# EAGLE design AS3364_quad_mixer_0402_DIL-inv_v1.0 (EAGLE 7.7.0)
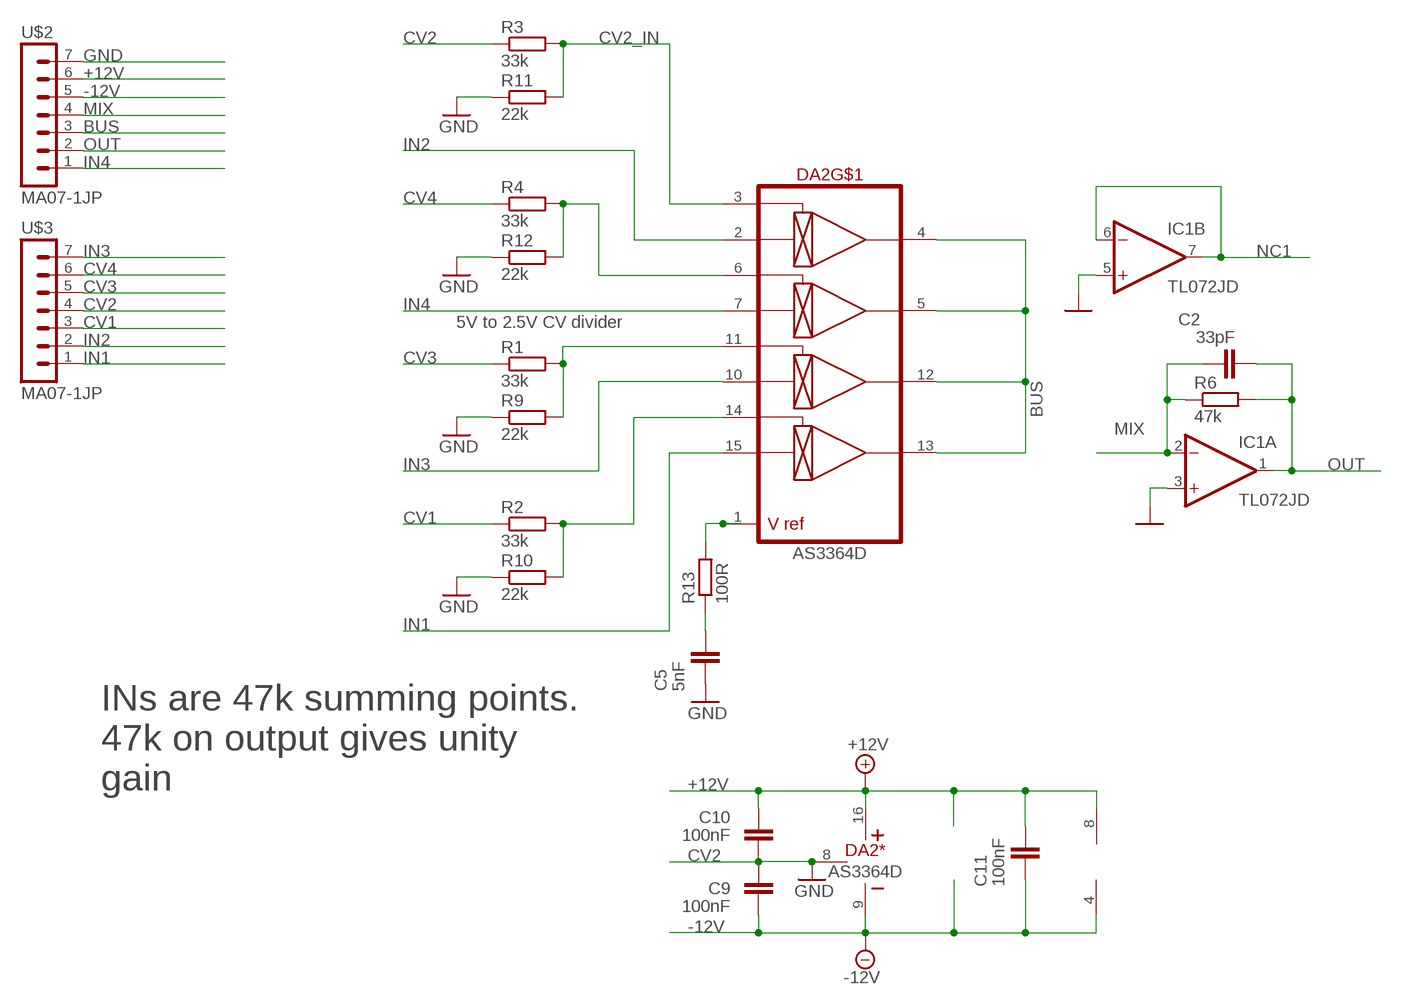
[diagram p0: schematic, sheet 1]

## Parts
C2  33pF  C-EUC0402  [C0402]
C5  5nF  C-EUC0402  [C0402]
C9  100nF  C-EUC0402  [C0402]
C10  100nF  C-EUC0402  [C0402]
C11  100nF  C-EUC0402  [C0402]
DA2  AS3364D  [DIL16J]
IC1  TL072JD  [SO08J]
R1  33k  R-EU_R0402  [R0402]
R2  33k  R-EU_R0402  [R0402]
R3  33k  R-EU_R0402  [R0402]
R4  33k  R-EU_R0402  [R0402]
R6  47k  R-EU_R0402  [R0402]
R9  22k  R-EU_R0402  [R0402]
R10  22k  R-EU_R0402  [R0402]
R11  22k  R-EU_R0402  [R0402]
R12  22k  R-EU_R0402  [R0402]
R13  100R  R-EU_R0402  [R0402]
U$2  MA07-1JP  [SIP-PIN07-1J]
U$3  MA07-1JP  [SIP-PIN07-1J]

## Nets
+12V: C10.2 C11.2 DA2.16(*:V+) IC1.8(P:V+) U$2.6
-12V: C9.1 C11.1 DA2.9(*:V-) IC1.4(P:V-) U$2.5
BUS: DA2.4(OUT1) DA2.5(OUT2) DA2.12(OUT3) DA2.13(OUT4) U$2.3
CV1: R2.1 U$3.3
CV2: R3.1 U$3.4
CV2_IN: DA2.3(CV1) R3.2 R11.2
CV3: R1.1 U$3.5
CV4: R4.1 U$3.6
GND: C5.1 C9.2 C10.1 DA2.8(*:GND) IC1.3(A:+IN) IC1.5(B:+IN) R9.1 R10.1 R11.1 R12.1 U$2.7
IN1: DA2.15(IN4) U$3.1
IN2: DA2.2(IN1) U$3.2
IN3: DA2.10(IN3) U$3.7
IN4: DA2.7(IN2) U$2.1
MIX: C2.1 IC1.2(A:-IN) R6.1 U$2.4
N$2: DA2.1(VREF) R13.2
N$10: DA2.6(CV2) R4.2 R12.2
N$12: DA2.11(CV3) R1.2 R9.2
N$14: C5.2 R13.1
N$21: DA2.14(CV4) R2.2 R10.2
NC1: IC1.6(B:-IN) IC1.7(B:OUT)
OUT: C2.2 IC1.1(A:OUT) R6.2 U$2.2

## Notes on the sheet
- 5V to 2.5V CV divider
- INs are 47k summing points.
  47k on output gives unity
  gain

## Library data of the parts
C2 C5 C9-C11 = rcl:C-EU: CAPACITOR, European symbol; SPICEPREFIX: C
DA2 = joakim:AS3364: AS3364 quad linear VCA, CEM3360 style. CV is 0 to 2V Vcc-Vee = 26V max, so +/-12V or +15V/-9V
IC1 = joakim:TL072J: OP AMP
R1-R4 R6 R9-R13 = rcl:R-EU_: RESISTOR, European symbol; SPICEPREFIX: R
U$2 U$3 = joakim:MA07-1J

## Board
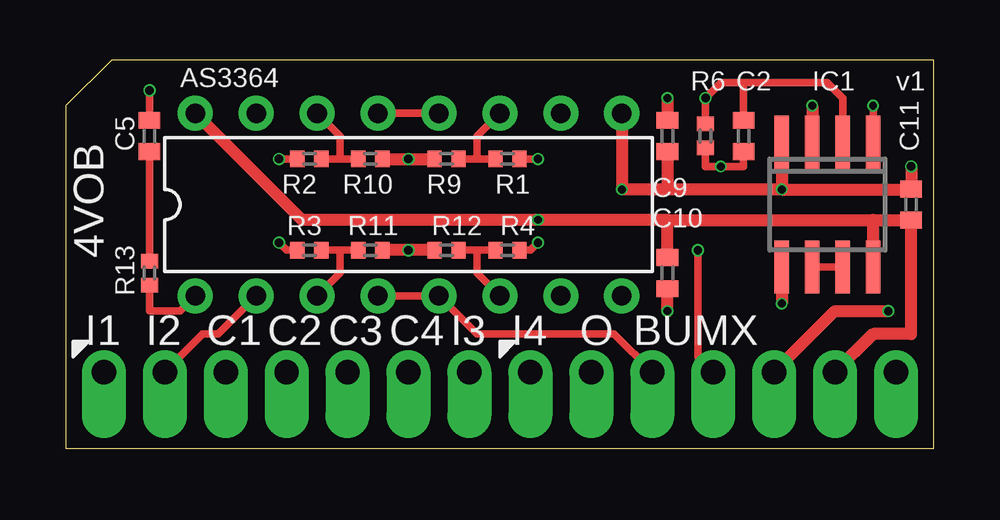
[diagram p1: board, top side]
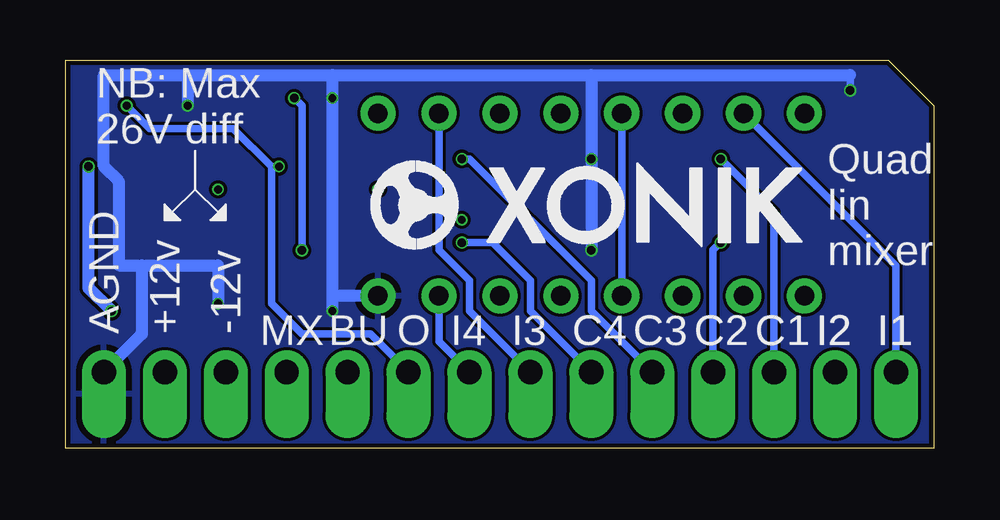
[diagram p2: board, bottom side, seen from below]

Size 36.2 x 16.19 mm. Coordinates in mm from the lower left corner, seen from the top.
Outline: 0,0 36.2,0 36.2,16.19 1.91,16.19 0,14.29 0,0
Copper layers (1*16): Top 0.035mm / dielectric 1.6mm / Bottom 0.035mm
Design rules "jlcpcb-2layers": minimum track width 5mil, minimum drill 0.3mm, track to track 5mil, track to pad 5mil, pad to pad 5mil, via to via 5mil, smd to smd 5mil, copper to edge 0.2mm, drill to drill 6mil, minimum pad ring 10mil, minimum via ring 3mil, stop-mask expansion 4mil, vias tented up to drill 0mil, thermal gap 10mil

### Footprints (pad centres in the part's own frame; a part is rotated, then mirrored left to right if it is on the bottom)
C0402 = smd 0.7 x 0.9: 1 -0.65,0; 2 0.65,0
DIL16J = drill 0.813: 1 -8.89,-3.81; 2 -6.35,-3.81; 3 -3.81,-3.81; 4 -1.27,-3.81; 5 1.27,-3.81; 6 3.81,-3.81; 7 6.35,-3.81; 8 8.89,-3.81; 9 8.89,3.81; 10 6.35,3.81; 11 3.81,3.81; 12 1.27,3.81; 13 -1.27,3.81; 14 -3.81,3.81; 15 -6.35,3.81; 16 -8.89,3.81
SO08J = smd 0.6 x 2.2: 1 -1.905,-2.6; 2 -0.635,-2.6; 3 0.635,-2.6; 4 1.905,-2.6; 5 1.905,2.6; 6 0.635,2.6; 7 -0.635,2.6; 8 -1.905,2.6
R0402 = smd 0.6 x 0.7: 1 -0.5,0; 2 0.5,0
SIP-PIN07-1J = drill 1.016 offset: 1 -7.62,0; 2 -5.08,0; 3 -2.54,0; 4 0,0; 5 2.54,0; 6 5.08,0; 7 7.62,0

### Placement (x,y rotation side)
C2  28.26,13.02 270 top
C5  3.49,13.02 270 top
C9  25.08,13.02 90 top
C10  25.08,7.3 90 top
C11  35.24,10.16 270 top
DA2  14.29,10.16 0 top
IC1  31.75,10.16 180 top
R1  18.41,12.06 180 top
R2  10.16,12.06 0 top
R3  10.16,8.26 0 top
R4  18.41,8.26 180 top
R6  26.67,13.02 270 top
R9  15.88,12.06 0 top
R10  12.7,12.06 180 top
R11  12.7,8.26 180 top
R12  15.88,8.26 0 top
R13  3.49,7.3 270 top
U$1  [XONIK_LOGO_18]  23.5,8.31 0 bottom
U$2  26.99,3.17 0 top
U$3  9.21,3.17 0 top

### Tracks (layer width: path | path; a pad name or v marks a point on that pad's centre or on a via)
+12V  (via drill 0.33)
  Top 0.508: 25.08,9.53 33.66,9.53 | 25.08,9.53 v19.68,9.53 9.84,9.53 DA2.16 | C10.2 25.08,9.53 | IC1.8 33.66,9.53 | 33.66,9.53 35.23,9.53 C11.2 35.24,4.76 33.66,4.76 U$2.6
-12V  (via drill 0.33, 0.35)
  Top 0.508: IC1.4 v29.84,10.79 | v29.84,10.79 25.08,10.79 | 25.08,10.79 v23.18,10.79 DA2.9 | C9.1 25.08,10.79 | U$2.5 32.07,5.71 v34.29,5.71 | v35.24,11.75 C11.1 35.23,10.79 v29.84,10.79
  Bottom 0.508: v34.29,5.71 35.24,6.67 v35.24,11.75
BUS
  Top 0.305: DA2.4 DA2.5 17.14,4.76 22.86,4.76 U$2.3 | DA2.13 DA2.12
  Bottom 0.305: DA2.4 DA2.13
CV1  (via drill 0.35)
  Top 0.305: R2.1 v8.89,12.06
  Bottom 0.305: v8.89,12.06 6.67,9.84 U$3.3
CV2  (via drill 0.35)
  Top 0.305: v8.89,8.57 9.21,8.26 R3.1
  Bottom 0.305: v8.89,8.57 9.21,8.26 U$3.4
CV2_IN
  Top 0.305: 11.43,8.26 11.43,7.3 DA2.3 | 11.43,8.26 R11.2 | R3.2 11.43,8.26
CV3  (via drill 0.35)
  Top 0.305: v19.68,12.06 R1.1
  Bottom 0.305: U$3.5 14.29,5.71 14.29,6.99 19.37,12.06 v19.68,12.06
CV4  (via drill 0.35)
  Top 0.305: R4.1 19.37,8.26 v19.68,8.57
  Bottom 0.305: v19.68,8.57 18.41,8.57 16.83,6.99 16.83,5.71 U$3.6
GND  (via drill 0.33, 0.35)
  Top 0.305: C5.1 v3.49,14.92
  Top 0.508: v25.08,14.61 C9.2 | v25.08,5.71 C10.1 | v31.11,14.29 IC1.3 | R11.1 v14.29,8.26 R12.1 | R10.1 v14.29,12.06 R9.1 | IC1.5 v29.84,6.03
  Bottom 0.305: v3.49,14.92 3.49,15.56
  Bottom 0.508: 31.11,15.56 34.61,15.56 34.61,11.75 33.97,11.11 33.97,7.62 33.02,7.62 | 31.11,15.56 25.08,15.56 | 25.08,15.56 14.29,15.56 | 14.29,15.56 3.49,15.56 | 25.08,15.56 v25.08,14.61 25.08,6.35 | 31.11,15.56 v31.11,14.29 | 25.08,6.35 v25.08,5.71 | 33.02,7.62 29.84,7.62 v29.84,6.03 | 33.02,7.62 33.02,4.76 U$2.7 | 14.29,15.56 v14.29,12.06 v14.29,8.26 | DA2.8 25.08,6.35
  pour Bottom: 0,0 0,17.14 36.2,17.14 36.2,0
IN1
  Bottom 0.305: U$3.1 1.59,7.62 DA2.15
IN2
  Top 0.305: U$3.2 5.71,4.76 6.35,4.76 DA2.2
IN3
  Bottom 0.305: U$3.7 19.37,5.71 19.37,6.99 20.64,8.26 DA2.10
IN4
  Bottom 0.305: U$2.1 20.64,4.45 DA2.7
MIX  (via drill 0.35)
  Top 0.305: R6.1 v26.67,14.61 27.3,15.24 28.26,15.24 | IC1.2 32.38,14.61 31.75,15.24 28.26,15.24 | C2.1 28.26,15.24 | U$2.4 26.35,3.81 v26.35,8.26
  Bottom 0.305: v26.35,8.26 26.35,14.29 v26.67,14.61
N$2
  Top 0.305: R13.2 3.49,5.71 4.76,5.71 DA2.1
N$10
  Top 0.305: R12.2 R4.2 17.14,8.26 17.14,7.3 DA2.6
N$12
  Top 0.305: 17.14,12.06 17.14,13.02 DA2.11 | R1.2 17.14,12.06 | 17.14,12.06 R9.2
N$14
  Top 0.305: C5.2 R13.1
N$21
  Top 0.305: 11.43,12.06 11.43,13.02 DA2.14 | R2.2 11.43,12.06 | 11.43,12.06 R10.2
NC1
  Top 0.305: IC1.6 IC1.7
OUT  (via drill 0.33)
  Top 0.305: R6.2 26.67,11.75 v27.3,11.75 28.26,11.75 C2.2 | IC1.1 v33.66,14.29
  Bottom 0.305: v33.66,14.29 32.7,13.34 29.21,13.34 27.62,11.75 | v27.3,11.75 27.62,11.75 | 27.62,11.75 27.62,6.03 26.35,4.76 23.5,4.76 U$2.2

### Text on the board
tNames: AS3364 | v1 | 4VOB | I1 | I2 | C1 | C2 | C3 | C4 | I3 | I4 | O | BU | MX
bNames: NB: Max / 26V diff | Quad / lin / mixer | -12v | +12v | AGND | I1 | I1 | I2 | I2 | C1 | C2 | C3 | C4 | I3 | I4 | O | BU | MX